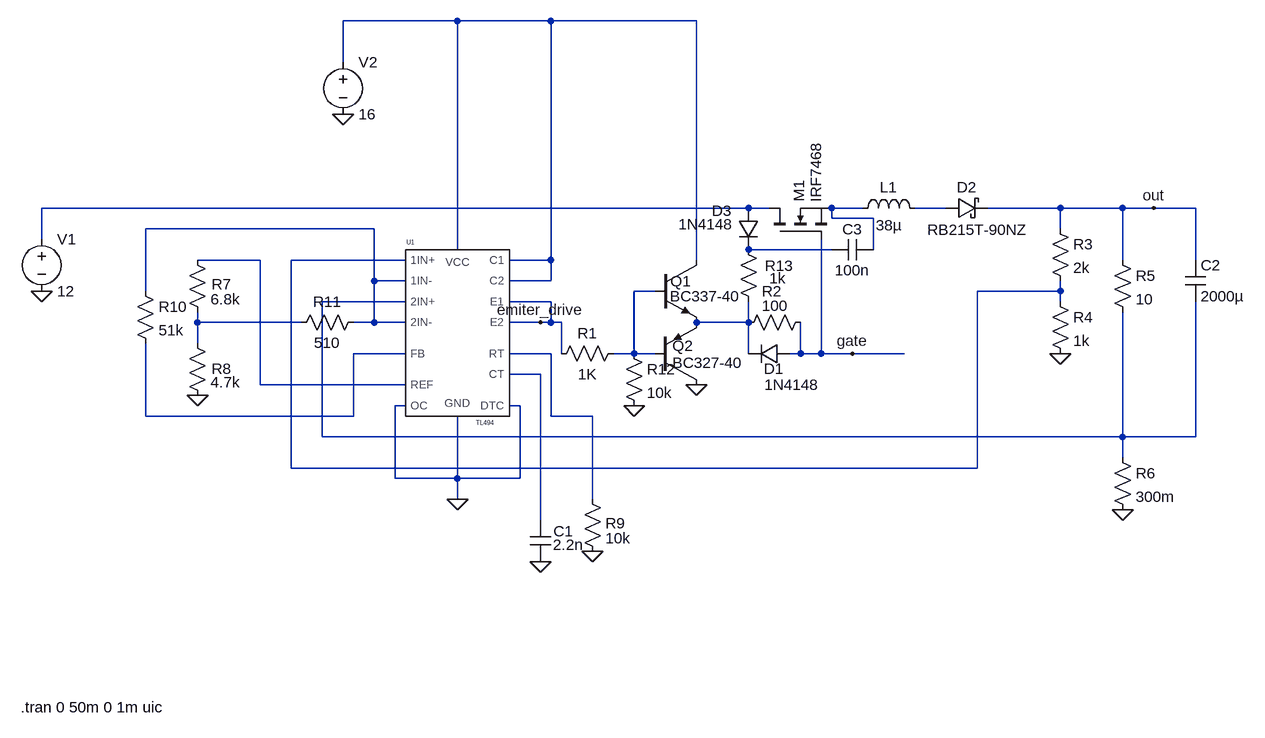
[diagram p0: schematic tl494_boost.asc]
tl494_boost.asc, the LTspice schematic file:
Version 4
SHEET 1 1428 768
WIRE 208 -304 32 -304
WIRE 352 -304 208 -304
WIRE 576 -304 352 -304
WIRE 32 -240 32 -304
WIRE 656 -16 -432 -16
WIRE 688 -16 656 -16
WIRE 784 -16 768 -16
WIRE 832 -16 784 -16
WIRE 960 -16 912 -16
WIRE 1136 -16 1024 -16
WIRE 1232 -16 1136 -16
WIRE 1280 -16 1232 -16
WIRE 1344 -16 1280 -16
WIRE 784 0 784 -16
WIRE 848 0 784 0
WIRE 80 16 -272 16
WIRE 1136 16 1136 -16
WIRE -432 32 -432 -16
WIRE 208 48 208 -304
WIRE 784 48 656 48
WIRE 848 48 848 0
WIRE -96 64 -192 64
WIRE 128 64 -48 64
WIRE 352 64 352 -304
WIRE 352 64 288 64
WIRE 576 64 576 -304
WIRE 1232 64 1232 -16
WIRE 1344 64 1344 -16
WIRE 80 96 80 16
WIRE 128 96 80 96
WIRE 352 96 352 64
WIRE 352 96 288 96
WIRE -272 112 -272 16
WIRE 512 112 480 112
WIRE 1136 112 1136 96
WIRE 1136 112 1008 112
WIRE 128 128 0 128
WIRE 352 128 288 128
WIRE 1136 128 1136 112
WIRE -192 160 -192 144
WIRE -32 160 -192 160
WIRE 80 160 80 96
WIRE 80 160 48 160
WIRE 128 160 80 160
WIRE 336 160 288 160
WIRE 352 160 352 128
WIRE 352 160 336 160
WIRE 368 160 352 160
WIRE 656 160 656 128
WIRE 656 160 576 160
WIRE -192 192 -192 160
WIRE 128 208 48 208
WIRE 352 208 288 208
WIRE 368 208 368 160
WIRE 480 208 480 112
WIRE 480 208 448 208
WIRE 512 208 480 208
WIRE 656 208 656 160
WIRE 736 208 736 160
WIRE 736 208 720 208
WIRE 768 208 768 32
WIRE 768 208 736 208
WIRE 816 208 768 208
WIRE 896 208 816 208
WIRE 336 240 288 240
WIRE -96 256 -96 64
WIRE 128 256 -96 256
WIRE 128 288 112 288
WIRE 304 288 288 288
WIRE -272 304 -272 192
WIRE 48 304 48 208
WIRE 48 304 -272 304
WIRE 352 304 352 208
WIRE 416 304 352 304
WIRE 0 336 0 128
WIRE 1232 336 1232 144
WIRE 1232 336 0 336
WIRE 1344 336 1344 128
WIRE 1344 336 1232 336
WIRE 1232 368 1232 336
WIRE -48 384 -48 64
WIRE 1008 384 1008 112
WIRE 1008 384 -48 384
WIRE 112 400 112 288
WIRE 208 400 208 304
WIRE 208 400 112 400
WIRE 304 400 304 288
WIRE 304 400 208 400
WIRE 208 432 208 400
WIRE 416 432 416 304
WIRE 336 464 336 240
FLAG 576 256 0
FLAG 1136 208 0
FLAG 1232 448 0
FLAG -432 112 0
FLAG -192 272 0
FLAG 416 512 0
FLAG 336 528 0
FLAG 208 432 0
FLAG 1280 -16 out
FLAG 336 160 emiter_drive
FLAG 816 208 gate
FLAG 32 -160 0
FLAG 480 288 0
SYMBOL nmos 688 32 R270
WINDOW 0 57 46 Left 2
SYMATTR InstName M1
SYMATTR Value IRF7468
SYMBOL npn 512 64 R0
WINDOW 0 24 33 Left 2
WINDOW 3 23 56 Left 2
SYMATTR InstName Q1
SYMATTR Value BC337-40
SYMBOL pnp 512 256 M180
WINDOW 0 27 60 Left 2
WINDOW 3 27 34 Left 2
SYMATTR InstName Q2
SYMATTR Value BC327-40
SYMBOL res 464 192 R90
WINDOW 0 0 56 VBottom 2
WINDOW 3 32 56 VTop 2
SYMATTR InstName R1
SYMATTR Value 1K
SYMATTR SpiceLine tol=1 pwr=0.1
SYMBOL res 752 144 R90
WINDOW 0 -16 60 VBottom 2
WINDOW 3 -25 55 VTop 2
SYMATTR InstName R2
SYMATTR Value 100
SYMATTR SpiceLine tol=1 pwr=0.1
SYMBOL diode 720 192 R90
WINDOW 0 55 25 VBottom 2
WINDOW 3 48 -3 VTop 2
SYMATTR InstName D1
SYMATTR Value 1N4148
SYMBOL ind 816 0 R270
WINDOW 0 32 56 VTop 2
WINDOW 3 5 56 VBottom 2
SYMATTR InstName L1
SYMATTR Value 38µ
SYMBOL schottky 960 0 R270
WINDOW 0 32 32 VTop 2
WINDOW 3 -2 49 VBottom 2
SYMATTR InstName D2
SYMATTR Value RB215T-90NZ
SYMATTR Description Diode
SYMATTR Type diode
SYMBOL res 1120 0 R0
SYMATTR InstName R3
SYMATTR Value 2k
SYMBOL res 1120 112 R0
SYMATTR InstName R4
SYMATTR Value 1k
SYMBOL res 1216 48 R0
SYMATTR InstName R5
SYMATTR Value 10
SYMBOL res 1216 352 R0
SYMATTR InstName R6
SYMATTR Value 300m
SYMBOL res -208 48 R0
WINDOW 0 38 53 Left 2
SYMATTR InstName R7
SYMATTR Value 6.8k
SYMBOL res -208 176 R0
WINDOW 0 38 55 Left 2
SYMATTR InstName R8
SYMATTR Value 4.7k
SYMBOL voltage -432 16 R0
WINDOW 123 0 0 Left 0
WINDOW 39 0 0 Left 0
SYMATTR InstName V1
SYMATTR Value 12
SYMBOL res 400 416 R0
WINDOW 0 36 53 Left 2
SYMATTR InstName R9
SYMATTR Value 10k
SYMBOL cap 320 464 R0
WINDOW 0 36 17 Left 2
WINDOW 3 35 38 Left 2
SYMATTR InstName C1
SYMATTR Value 2.2n
SYMBOL cap 1328 64 R0
SYMATTR InstName C2
SYMATTR Value 2000µ
SYMBOL TL494 208 176 R0
SYMATTR InstName U1
SYMBOL res -288 96 R0
SYMATTR InstName R10
SYMATTR Value 51k
SYMBOL res 64 144 R90
WINDOW 0 0 56 VBottom 2
WINDOW 3 32 56 VTop 2
SYMATTR InstName R11
SYMATTR Value 510
SYMBOL voltage 32 -256 R0
WINDOW 123 0 0 Left 0
WINDOW 39 0 0 Left 0
SYMATTR InstName V2
SYMATTR Value 16
SYMBOL res 464 192 R0
SYMATTR InstName R12
SYMATTR Value 10k
SYMBOL diode 640 -16 R0
WINDOW 0 -40 4 Left 2
WINDOW 3 -92 25 Left 2
SYMATTR InstName D3
SYMATTR Value 1N4148
SYMBOL res 640 32 R0
WINDOW 0 41 41 Left 2
WINDOW 3 48 60 Left 2
SYMATTR InstName R13
SYMATTR Value 1k
SYMBOL cap 848 32 R90
WINDOW 0 0 32 VBottom 2
WINDOW 3 32 32 VTop 2
SYMATTR InstName C3
SYMATTR Value 100n
TEXT -464 752 Left 2 !.tran 0 50m 0 1m uic

The netlist it stands for:
* tl494_boost.asc
M1 N002 gate N003 N003 IRF7468
Q1 N001 N009 N012 0 BC337-40
Q2 0 N009 N012 0 BC327-40
R1 N009 emiter_drive 1K tol=1 pwr=0.1
R2 gate N012 100 tol=1 pwr=0.1
D1 gate N012 1N4148
L1 N003 N004 38µ
D2 N004 out RB215T-90NZ
R3 out N008 2k
R4 N008 0 1k
R5 out N010 10
R6 N010 0 300m
R7 N007 N011 6.8k
R8 N011 0 4.7k
V1 N002 0 12
R9 N014 0 10k
C1 N015 0 2.2n
C2 out N010 2000µ
XU1 N008 N005 N013 0 N015 N014 0 N001 emiter_drive emiter_drive N001 N001 0 N007 N005 N010 TL494  ; pins 1IN+ 1IN- FB DTC CT RT GND C1 E1 E2 C2 VCC OC REF 2IN- 2IN+
R10 N005 N013 51k
R11 N005 N011 510
V2 N001 0 16
R12 N009 0 10k
D3 N002 N006 1N4148
R13 N006 N012 1k
C3 N003 N006 100n
.model D D
.lib standard.dio
.model NPN NPN
.model PNP PNP
.lib standard.bjt
.model NMOS NMOS
.model PMOS PMOS
.lib standard.mos
.tran 0 50m 0 1m uic
.lib c:\Users\LPC-user\AppData\Local\LTspice\lib\sub\TL494.sub
.backanno
.end